# EAGLE schematic WS2812-Ring (EAGLE 7.3.0)
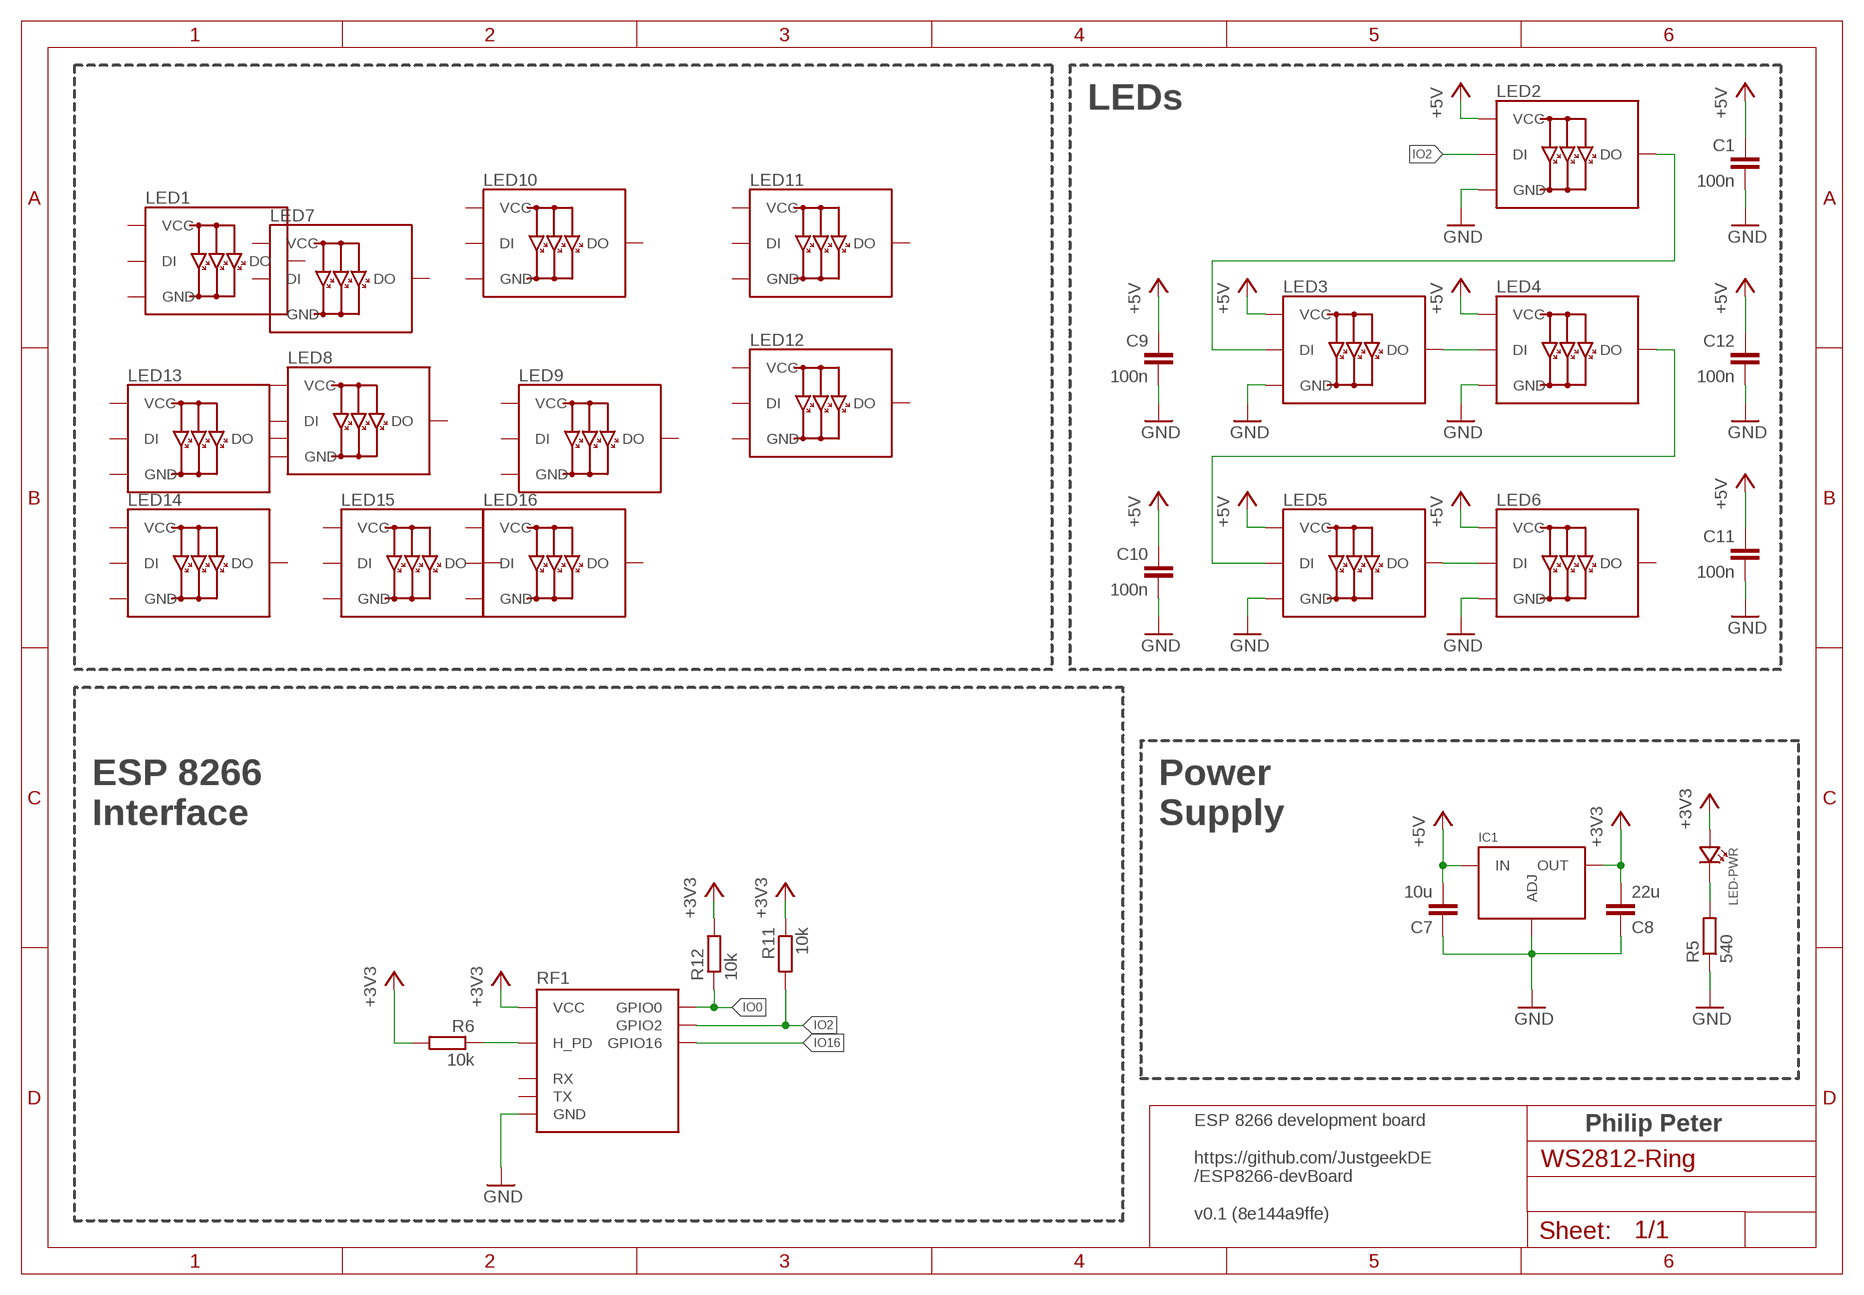
[diagram p0: schematic, sheet 1]

## Parts
C1  100n  C-EUC0805  [C0805]
C7  10u  C-EUC0805  [C0805]
C8  22u  C-EUC0805  [C0805]
C9  100n  C-EUC0805  [C0805]
C10  100n  C-EUC0805  [C0805]
C11  100n  C-EUC0805  [C0805]
C12  100n  C-EUC0805  [C0805]
IC1  REGULATOR-LM317-SOT223  [SOT223]
LED1  WS2812B  [CHIP-5050-4_PIN]
LED2  WS2812B  [CHIP-5050-4_PIN]
LED3  WS2812B  [CHIP-5050-4_PIN]
LED4  WS2812B  [CHIP-5050-4_PIN]
LED5  WS2812B  [CHIP-5050-4_PIN]
LED6  WS2812B  [CHIP-5050-4_PIN]
LED7  WS2812B  [CHIP-5050-4_PIN]
LED8  WS2812B  [CHIP-5050-4_PIN]
LED9  WS2812B  [CHIP-5050-4_PIN]
LED10  WS2812B  [CHIP-5050-4_PIN]
LED11  WS2812B  [CHIP-5050-4_PIN]
LED12  WS2812B  [CHIP-5050-4_PIN]
LED13  WS2812B  [CHIP-5050-4_PIN]
LED14  WS2812B  [CHIP-5050-4_PIN]
LED15  WS2812B  [CHIP-5050-4_PIN]
LED16  WS2812B  [CHIP-5050-4_PIN]
LED-PWR  LED0805  [CHIPLED_0805]
R5  540  R-EU_R0805  [R0805]
R6  10k  R-EU_R0805  [R0805]
R11  10k  R-EU_R0805  [R0805]
R12  10k  R-EU_R0805  [R0805]
RF1  ESP2866-ESP-01THT  [ESP8266-ESP-01]

## Nets
+3V3: C8.2 IC1.2(OUT) IC1.4(OUT) LED-PWR.A R6.2 R11.1 R12.2 RF1.VCC
+5V: C1.1 C7.2 C9.1 C10.1 C11.1 C12.1 IC1.3(IN) LED2.P$1(VCC) LED3.P$1(VCC) LED4.P$1(VCC) LED5.P$1(VCC) LED6.P$1(VCC)
GND: C1.2 C7.1 C8.1 C9.2 C10.2 C11.2 C12.2 IC1.1(ADJ) LED2.P$3(GND) LED3.P$3(GND) LED4.P$3(GND) LED5.P$3(GND) LED6.P$3(GND) R5.1 RF1.GND
IO0: R12.1 RF1.GPIO0
IO2: LED2.P$4(DI) R11.2 RF1.GPIO2
IO16: RF1.GPIO16
N$9: LED-PWR.C R5.2
N$12: LED2.P$2(DO) LED3.P$4(DI)
N$15: LED3.P$2(DO) LED4.P$4(DI)
N$16: LED4.P$2(DO) LED5.P$4(DI)
N$17: LED5.P$2(DO) LED6.P$4(DI)
RESET: R6.1 RF1.H_PD
Unconnected: LED1.P$1(VCC) LED1.P$2(DO) LED1.P$3(GND) LED1.P$4(DI) LED6.P$2(DO) LED7.P$1(VCC) LED7.P$2(DO) LED7.P$3(GND) LED7.P$4(DI) LED8.P$1(VCC) LED8.P$2(DO) LED8.P$3(GND) LED8.P$4(DI) LED9.P$1(VCC) LED9.P$2(DO) LED9.P$3(GND) LED9.P$4(DI) LED10.P$1(VCC) LED10.P$2(DO) LED10.P$3(GND) LED10.P$4(DI) LED11.P$1(VCC) LED11.P$2(DO) LED11.P$3(GND) LED11.P$4(DI) LED12.P$1(VCC) LED12.P$2(DO) LED12.P$3(GND) LED12.P$4(DI) LED13.P$1(VCC) LED13.P$2(DO) LED13.P$3(GND) LED13.P$4(DI) LED14.P$1(VCC) LED14.P$2(DO) LED14.P$3(GND) LED14.P$4(DI) LED15.P$1(VCC) LED15.P$2(DO) LED15.P$3(GND) LED15.P$4(DI) LED16.P$1(VCC) LED16.P$2(DO) LED16.P$3(GND) LED16.P$4(DI) RF1.RX RF1.TX

## Notes on the sheet
- LEDs
- ESP 8266
  Interface
- Power
  Supply
- ESP 8266 development board
  
  https://github.com/JustgeekDE
  /ESP8266-devBoard
  
  v0.1 (8e144a9ffe)
- Philip Peter

## Library data of the parts
C1 C7-C12 = p.peter-rcl:C-EU: CAPACITOR, European symbol
IC1 = p.peter-regulators:REGULATOR-LM317
LED1-LED16 = p.peter-leds:WS2812B
LED-PWR = p.peter-leds:LED
R5 R6 R11 R12 = p.peter-rcl:R-EU_: RESISTOR, European symbol
RF1 = p.peter-periphery:ESP2866-ESP-01